# Altium schematic sheet S7CAS-PLEIADES-CARTE-MERE_P20_Flash.SchDoc
size Tabloid; Sheet_Name: Insert name in Document Parameters; Size: 11x17
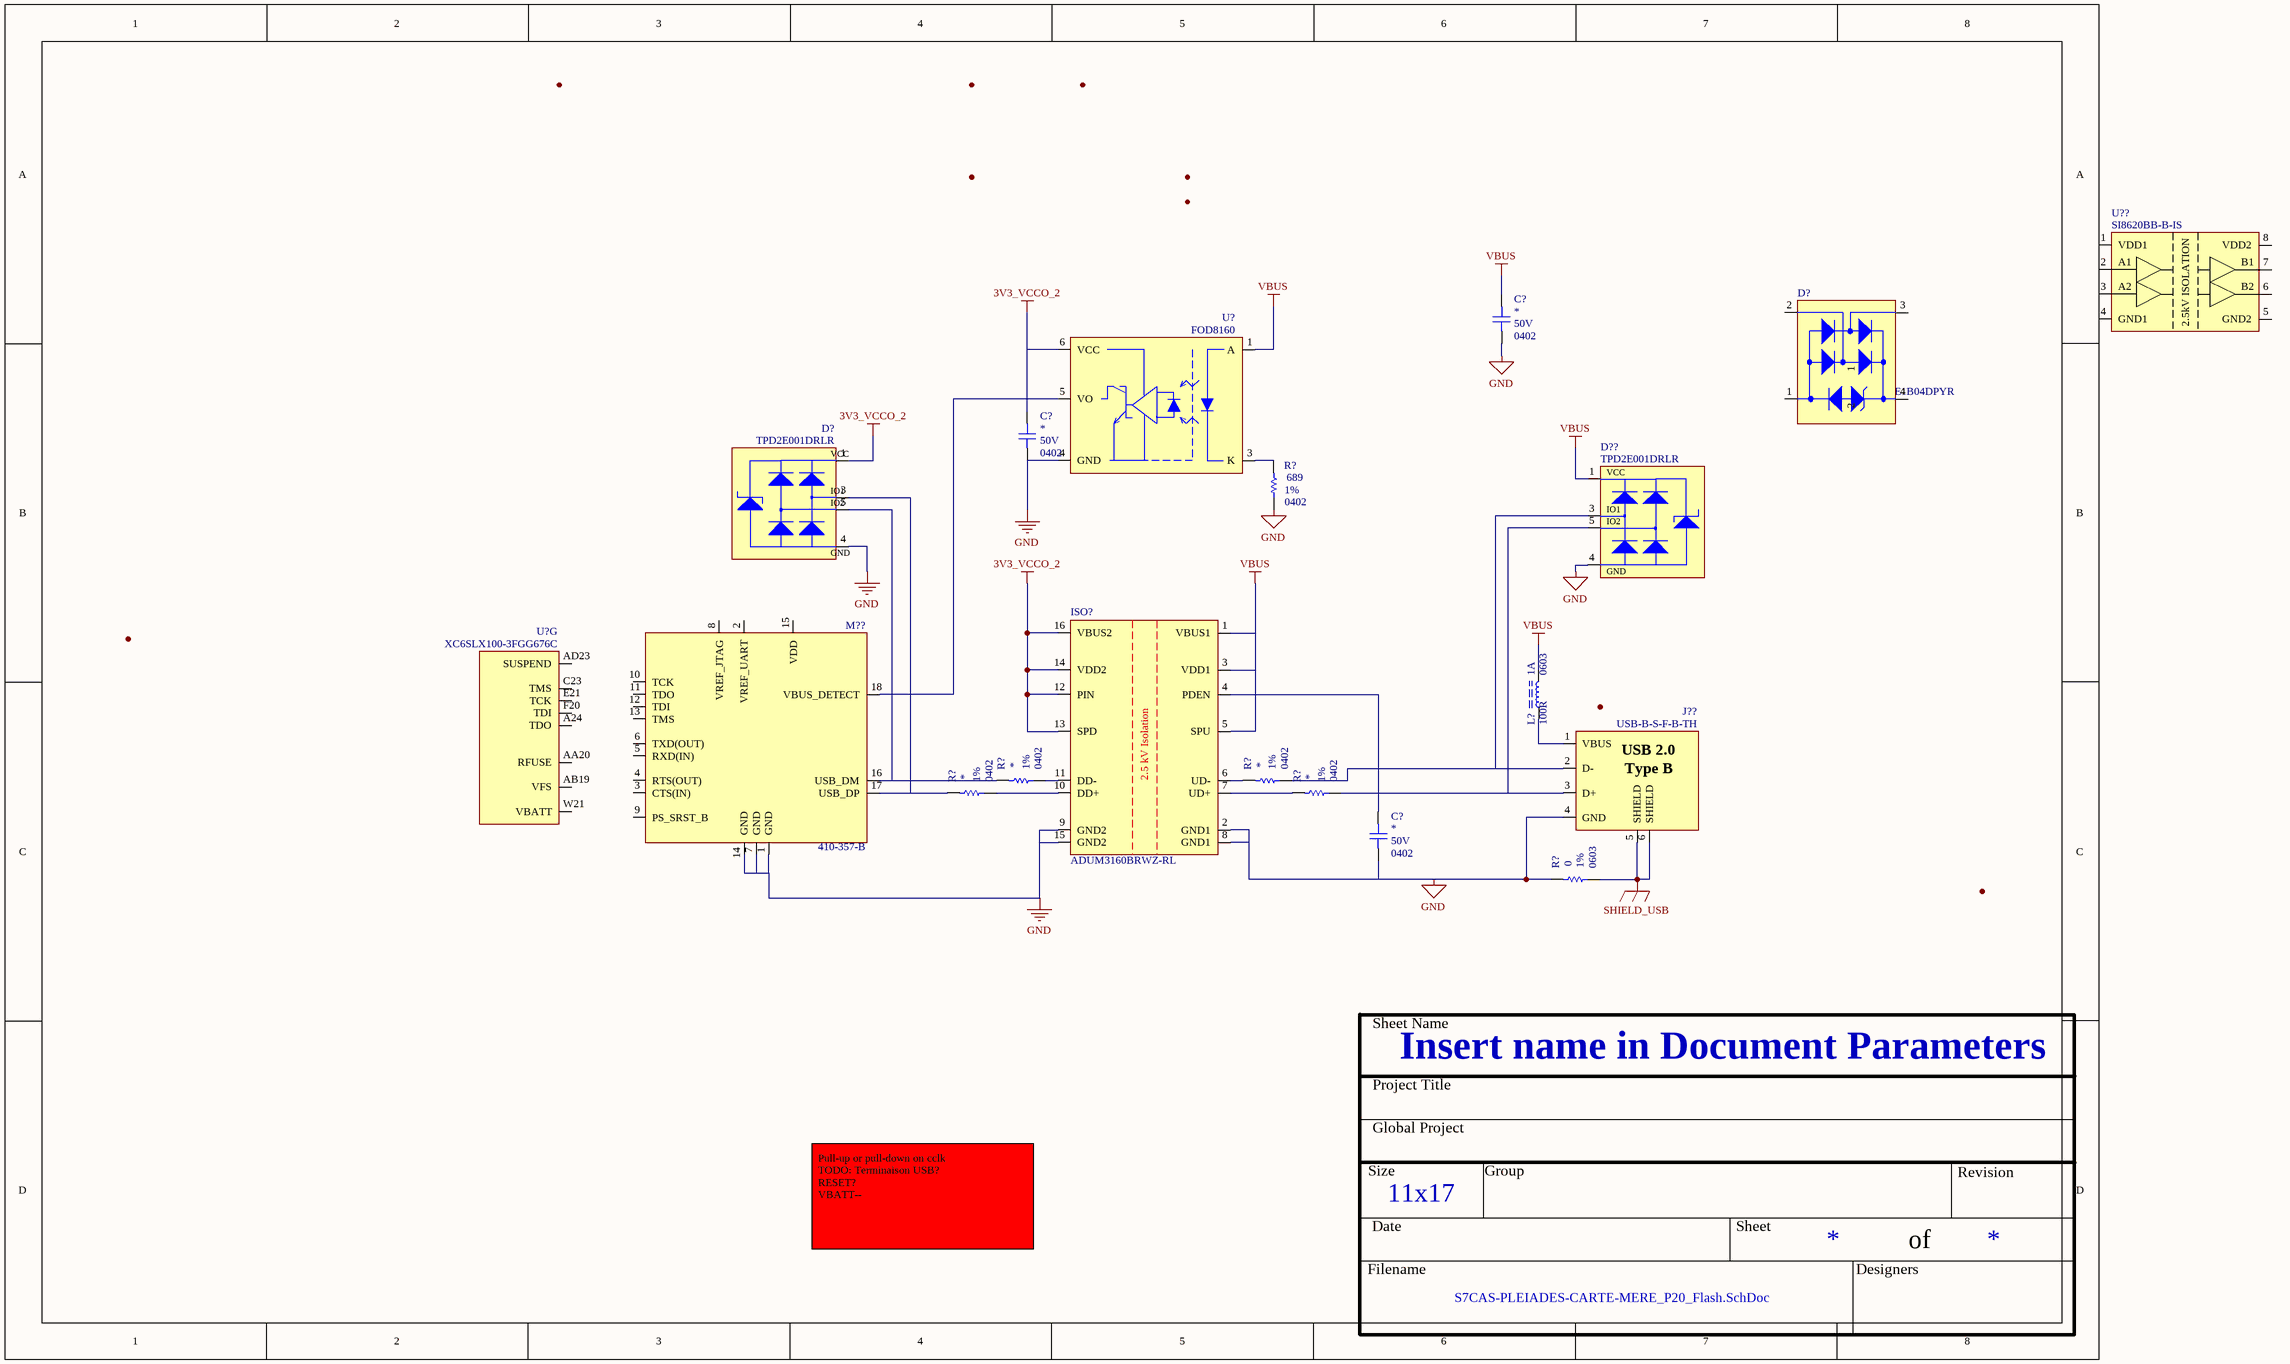
[diagram p0: S7CAS-PLEIADES-CARTE-MERE_P20_Flash.SchDoc]

## Parts
(Parts that share a designator on the sheet are numbered #1, #2 ... from top to bottom, then left to right.)
C?#1  Voltage: 50V  Package: 0402  [CAP_0402]  (hidden comment: CAP - 0402)
C?#2  Voltage: 50V  Package: 0402  [CAP_0402]  (hidden comment: CAP - 0402)
C?#3  Voltage: 50V  Package: 0402  [CAP_0402]  (hidden comment: CAP - 0402)
D?#1  SR3.3.TCT  [TVS_SR3.3.TCT]  (value not drawn)
D?#2  TPD2E001DRLR  [TVS_USB_TPD2E001DRLR]
D??#1  TPD1E1B04DPYR  [TVS_DATA_TPD1E1B04DPYR]
D??#2  TPD2E001DRLR  [TVS_USB_TPD2E001DRLR]
ISO?  ADUM3160BRWZ-RL  [ISO_ADUM3160BRWZ-RL]
J??  USB-B-S-F-B-TH  [CON_USB_USB-B-S-F-B-TH]
L?  value 100R  Current: 1A  Package: 0603  [FER_0603]  (hidden comment: FER - 0603)
M??  410-357-B  [MOD_JTAG_410-357-B]
R?#1  value 689  Package: 0402  Precision: 1%  [RES_0402]  (hidden comment: RES - 0402)
R?#2  Package: 0402  Precision: 1%  [RES_0402]  (hidden comment: RES - 0402)
R?#3  Package: 0402  Precision: 1%  [RES_0402]  (hidden comment: RES - 0402)
R?#4  Package: 0402  Precision: 1%  [RES_0402]  (hidden comment: RES - 0402)
R?#5  Package: 0402  Precision: 1%  [RES_0402]  (hidden comment: RES - 0402)
R?#6  value 0  Package: 0603  Precision: 1%  [RES_0603]  (hidden comment: RES - 0603)
U?#1  FOD8160
U?#2  XC6SLX100-3FGG676C  [FPGA_XILINX_FGG676]  (part G of 10)
U??  SI8620BB-B-IS  [ISO_SI8620BB-B-IS]

## Nets
3V3_VCCO_2: C?#2.2 D?#2.1(VCC) ISO?.12(PIN) ISO?.13(SPD) ISO?.14(VDD2) ISO?.16(VBUS2) U?#1.6(VCC)
GND: C?#1.1 C?#2.1 C?#3.1 D?#2.4(GND) D??#2.4(GND) ISO?.2(GND1) ISO?.8(GND1) ISO?.9(GND2) ISO?.15(GND2) J??.4(GND) M??.1(GND) M??.7(GND) M??.14(GND) R?#1.1 R?#6.2 U?#1.4(GND)
SHIELD_USB: J??.5(SHIELD) J??.6(SHIELD) R?#6.1
VBUS: C?#1.2 D??#2.1(VCC) ISO?.1(VBUS1) ISO?.3(VDD1) ISO?.5(SPU) L?.1 U?#1.1(A)
NetC?#3_2: C?#3.2 ISO?.4(PDEN)
NetD?#2_3: D?#2.3(IO1) M??.17(USB_DP) R?#4.2
NetD?#2_5: D?#2.5(IO2) M??.16(USB_DM) R?#2.2
NetD??#2_3: D??#2.3(IO1) J??.2(D-) R?#3.1
NetD??#2_5: D??#2.5(IO2) J??.3(D+) R?#5.1
NetISO?_6: ISO?.6(UD-) R?#3.2
NetISO?_7: ISO?.7(UD+) R?#5.2
NetISO?_10: ISO?.10(DD+) R?#4.1
NetISO?_11: ISO?.11(DD-) R?#2.1
NetJ??_1: J??.1(VBUS) L?.2
NetM??_18: M??.18(VBUS_DETECT) U?#1.5(VO)
NetR?#1_2: R?#1.2 U?#1.3(K)

Not connected (* = marked no-connect by the designer): D?#1 1(I/O) 2(VN) 3 4; D?#2 2(NC); D??#1 1(i/o) 2(i/o); D??#2 2(NC); M?? 2(VREF_UART) 3(CTS(IN)) 4(RTS(OUT)) 5(RXD(IN)) 6(TXD(OUT)) 8(VREF_JTAG) 9(PS_SRST_B) 10(TCK) 11(TDO) 12(TDI) 13(TMS) 15(VDD); U?#2 A24(TDO) AA20(RFUSE) AB19(VFS) AD23(SUSPEND) C23(TMS) E21(TCK) F20(TDI) W21(VBATT); U?? 1(VDD1) 2(A1) 3(A2) 4(GND1) 5(GND2) 6(B2) 7(B1) 8(VDD2)

## Notes on the sheet
- Pull-up or pull-down on cclk
  TODO: Terminaison USB?
  RESET?
  VBATT--
- Sheet Name
- Project Title
- Global Project
- Size
- Group
- Revision
- Date
- Sheet
- of
- Filename
- Designers
- (in symbol CON_USB_USB-B-S-F-B-TH) USB 2.0; Type B
- (in symbol ISO_ADUM3160BRWZ-RL) 2.5 kV Isolation
- (in symbol ISO_SI8620BB-B-IS) 2.5kV ISOLATION

## Library data of the parts
C?#1-C?#3 = CAP - 0402: Precision: 10%; Current: *; CreatedBy: Jonathan Bouchard; Power: *; Value: *
D?#1 = TVS_SR3.3.TCT: TVS - DIODE ARRAY 3.3V 150W - SOT143-4; Mfg: Semtech; Voltage: VBR=3.3V; Current: *; Mfg Part Number: SR3.3.TCT; HelpURL: http://www.semtech.com/images/datasheet/sr3.3.pdf; CreatedBy: Jonathan Bouchard; Temperature: -55°C to 125°C; Power: 150W; Package: SOT143-4; Precision: *; Value: *; Supplier 1: Digikey; Supplier Part Number 1: SR3.3DKR-ND
D?#2 D??#2 = TVS_USB_TPD2E001DRLR: TVS - USB TVS DIODE 5.5V - SOT-553; Manufacturer #1: Texas Instruments; Value: 11V Breakdown; Voltage Rating: 5.5V (Max); GRAMS Lib Spec: 2.8; Magnetic Material: YES; Cryo: UNKNOWN; Tolerance: *; Current Rating: *; Power Max: *; HelpURL: http://www.ti.com/lit/ds/symlink/tpd2e001.pdf; CreatedBy/Date: Jonathan Bouchard 2018-07-10; VerifiedBy: Arnaud Samson 16-07-18; Temperature: -40°C ~ 85°C (TA); Package: SOT-553; Manufacturer #2: *; Note: *; Assembly Type: SMD; Part Number #2: *; Part Number #1: TPD2E001DRLR; Polarized: YES; Supplier 1: Digi-Key; Supplier Part Number 1: 296-21883-1-ND
D??#1 = TVS_DATA_TPD1E1B04DPYR: TVS - TVS DIODE 3.6V 8.5V - 0402; Manufacturer #1: Texas Instruments; Current Rating: 6.3Apeak; Power Max: 50Wpeak; GRAMS Lib Spec: 2.8; Magnetic Material: Unknown; Polarized: No; Value: *; Tolerance: *; Voltage Rating: 3.6V; HelpURL: http://www.ti.com/lit/ds/symlink/tpd1e1b04.pdf; CreatedBy/Date: Keven Deslandes - 2018/10/19; VerifiedBy: Caroline Paulin - 28 janv 2019; Temperature: -40°C ~ 125°C (TA); Package: 0402; Manufacturer #2: *; Note: *; Assembly Type: SMD; Part Number #2: *; Part Number #1: TPD1E1B04DPYR; Supplier 1: Digi-Key; Supplier Part Number 1: 296-47364-1-ND; Cryo: UNKNOWN
ISO? = ISO_ADUM3160BRWZ-RL: ISO - DGTL ISO 2.5KV 2CH USB - 16SOIC; Manufacturer #1: Analog Devices; Value: 2500Vrms voltage isolation; Voltage Rating: 3~5.5V; GRAMS Lib Spec: 2.8; Magnetic Material: UNKNOWN; Polarized: Yes; Tolerance: *; Current Rating: *; Power Max: *; HelpURL: https://www.analog.com/media/en/technical-documentation/data-sheets/ADuM3160.pdf; CreatedBy/Date: Tommy Rossignol 2018-11-16; VerifiedBy: Caroline Paulin - 13 février 2019; Temperature: -40°C ~ 105°C; Package: 16-SOIC; Manufacturer #2: *; Assembly Type: SMD; Part Number #2: *; Part Number #1: ADUM3160BRWZ-RL; Supplier 1: Digi-Key; Supplier Part Number 1: ADUM3160BRWZ-RLCT-ND; Cryo: UNKNOWN
J?? = CON_USB_USB-B-S-F-B-TH: CON - USB B RECPT TH R/A - 4-TH; Manufacturer #1: Samtec Inc.; Value: USB B; Voltage Rating: 30VAC; GRAMS Lib Spec: 2.8c; Magnetic Material: UNKNOWN; Polarized: YES; Tolerance: *; Current Rating: *; Power Max: *; HelpURL: http://suddendocs.samtec.com/catalog_english/usb_b.pdf; CreatedBy/Date: Jonathan Bouchard 2020-03-24; VerifiedBy: C.Paulin - 22/04/2020; Temperature: -50°C ~ 85°C; Package: 4-TH; Manufacturer #2: *; Note: *; Assembly Type: TH; Part Number #2: *; Part Number #1: USB-B-S-F-B-TH; Supplier 1: Digi-Key; Supplier Part Number 1: SAM10867-ND; Cryo: UNKNOWN
M?? = MOD_JTAG_410-357-B: MOD - JTAG-SMT3-NC Programming Module For Xilinx FPGA - 18-SMT; Manufacturer #1: Digilent; Voltage Rating: VDD: 2.97V~3.63V, VJTAG/VUART: 1.65V~5.5V; GRAMS Lib Spec: 2.8; Note: Prior to reflow, the JTAG-SMT3-NC module must be dried at 125°C for 17 hours; Magnetic Material: Unknown; Polarized: Yes; Value: *; Tolerance: *; Current Rating: *; Power Max: *; HelpURL: https://reference.digilentinc.com/_media/reference/programmers/jtag-smt3/jtag-smt3-nc_rm.pdf; CreatedBy/Date: Tommy Rossignol 2018-11-23; VerifiedBy: Nicolas V. (2019-01-28); Temperature: -40°C ~ 85°C; Package: 18-pad SMT; Manufacturer #2: *; Assembly Type: SMD; Part Number #2: *; Part Number #1: 410-357-B; Supplier 1: Digi-Key; Supplier Part Number 1: 1286-1196-ND; Cryo: UNKNOWN
R?#1 = RES - 0402: Mfg Part Number: RGC1/16SC6980FTH; Voltage: 50V; Power: 1/16W; Current: *; CreatedBy: Jonathan Bouchard
R?#2-R?#5 = RES - 0402: Voltage: 50V; Power: 1/16W; Current: *; CreatedBy: Jonathan Bouchard; Value: *
U?#1 = OCTOCOUPLER_FOD8160: XXX - Description - Package; GRAMS Lib Spec: 2.7; HelpURL: https://www.onsemi.com/pdf/datasheet/fod8160-d.pdf
U?#2 = FPGA_XC6SLX100-3FGG676C: FPGA - XILINX SPARTAN 6 480 I/O - BGA-676; Voltage: 1.14 V ~ 1.26 V; Current: *; Power: *; Mfg: Xilinx; Mfg Part Number: XC6SLX100-3FGG676C; HelpURL: https://www.xilinx.com/support/documentation/data_sheets/ds162.pdf; CreatedBy: Jonathan Bouchard; Temperature: 0°C ~ 85°C (TJ); Value: *; Precision: *; Package: BGA-676; Supplier 1: Digikey; Supplier Part Number 1: 122-1760-ND
U?? = ISO_SI8620BB-B-IS: ISO - Dual-Channel Digital Isolator (default Low) - 8-SOIC; Manufacturer #1: Silicon Labs; Voltage Rating: 2.5-5.5V; GRAMS Lib Spec: 2.8; Magnetic Material: Unknown; Polarized: Yes; Value: *; Tolerance: *; Current Rating: *; Power Max: *; HelpURL: https://www.silabs.com/documents/public/data-sheets/si861x-2x-datasheet.pdf; CreatedBy/Date: Joel Lemay 2018-06-05; VerifiedBy: Caroline Paulin - 12 sept 2018; Temperature: -40°C ~ 125°C; Package: 8-SOIC; Manufacturer #2: *; Assembly Type: SMD; Part Number #2: *; Part Number #1: SI8620BB-B-IS; Supplier 1: Digi-Key; Supplier Part Number 1: 336-2567-ND; Cryo: UNKNOWN
L? = FER - 0603: Voltage: *; CreatedBy: Jonathan Bouchard; Power: *; Precision: *
R?#6 = RES - 0603: Current: *; CreatedBy: Jonathan Bouchard